# Altium project LVDS_Board.PrjPcb
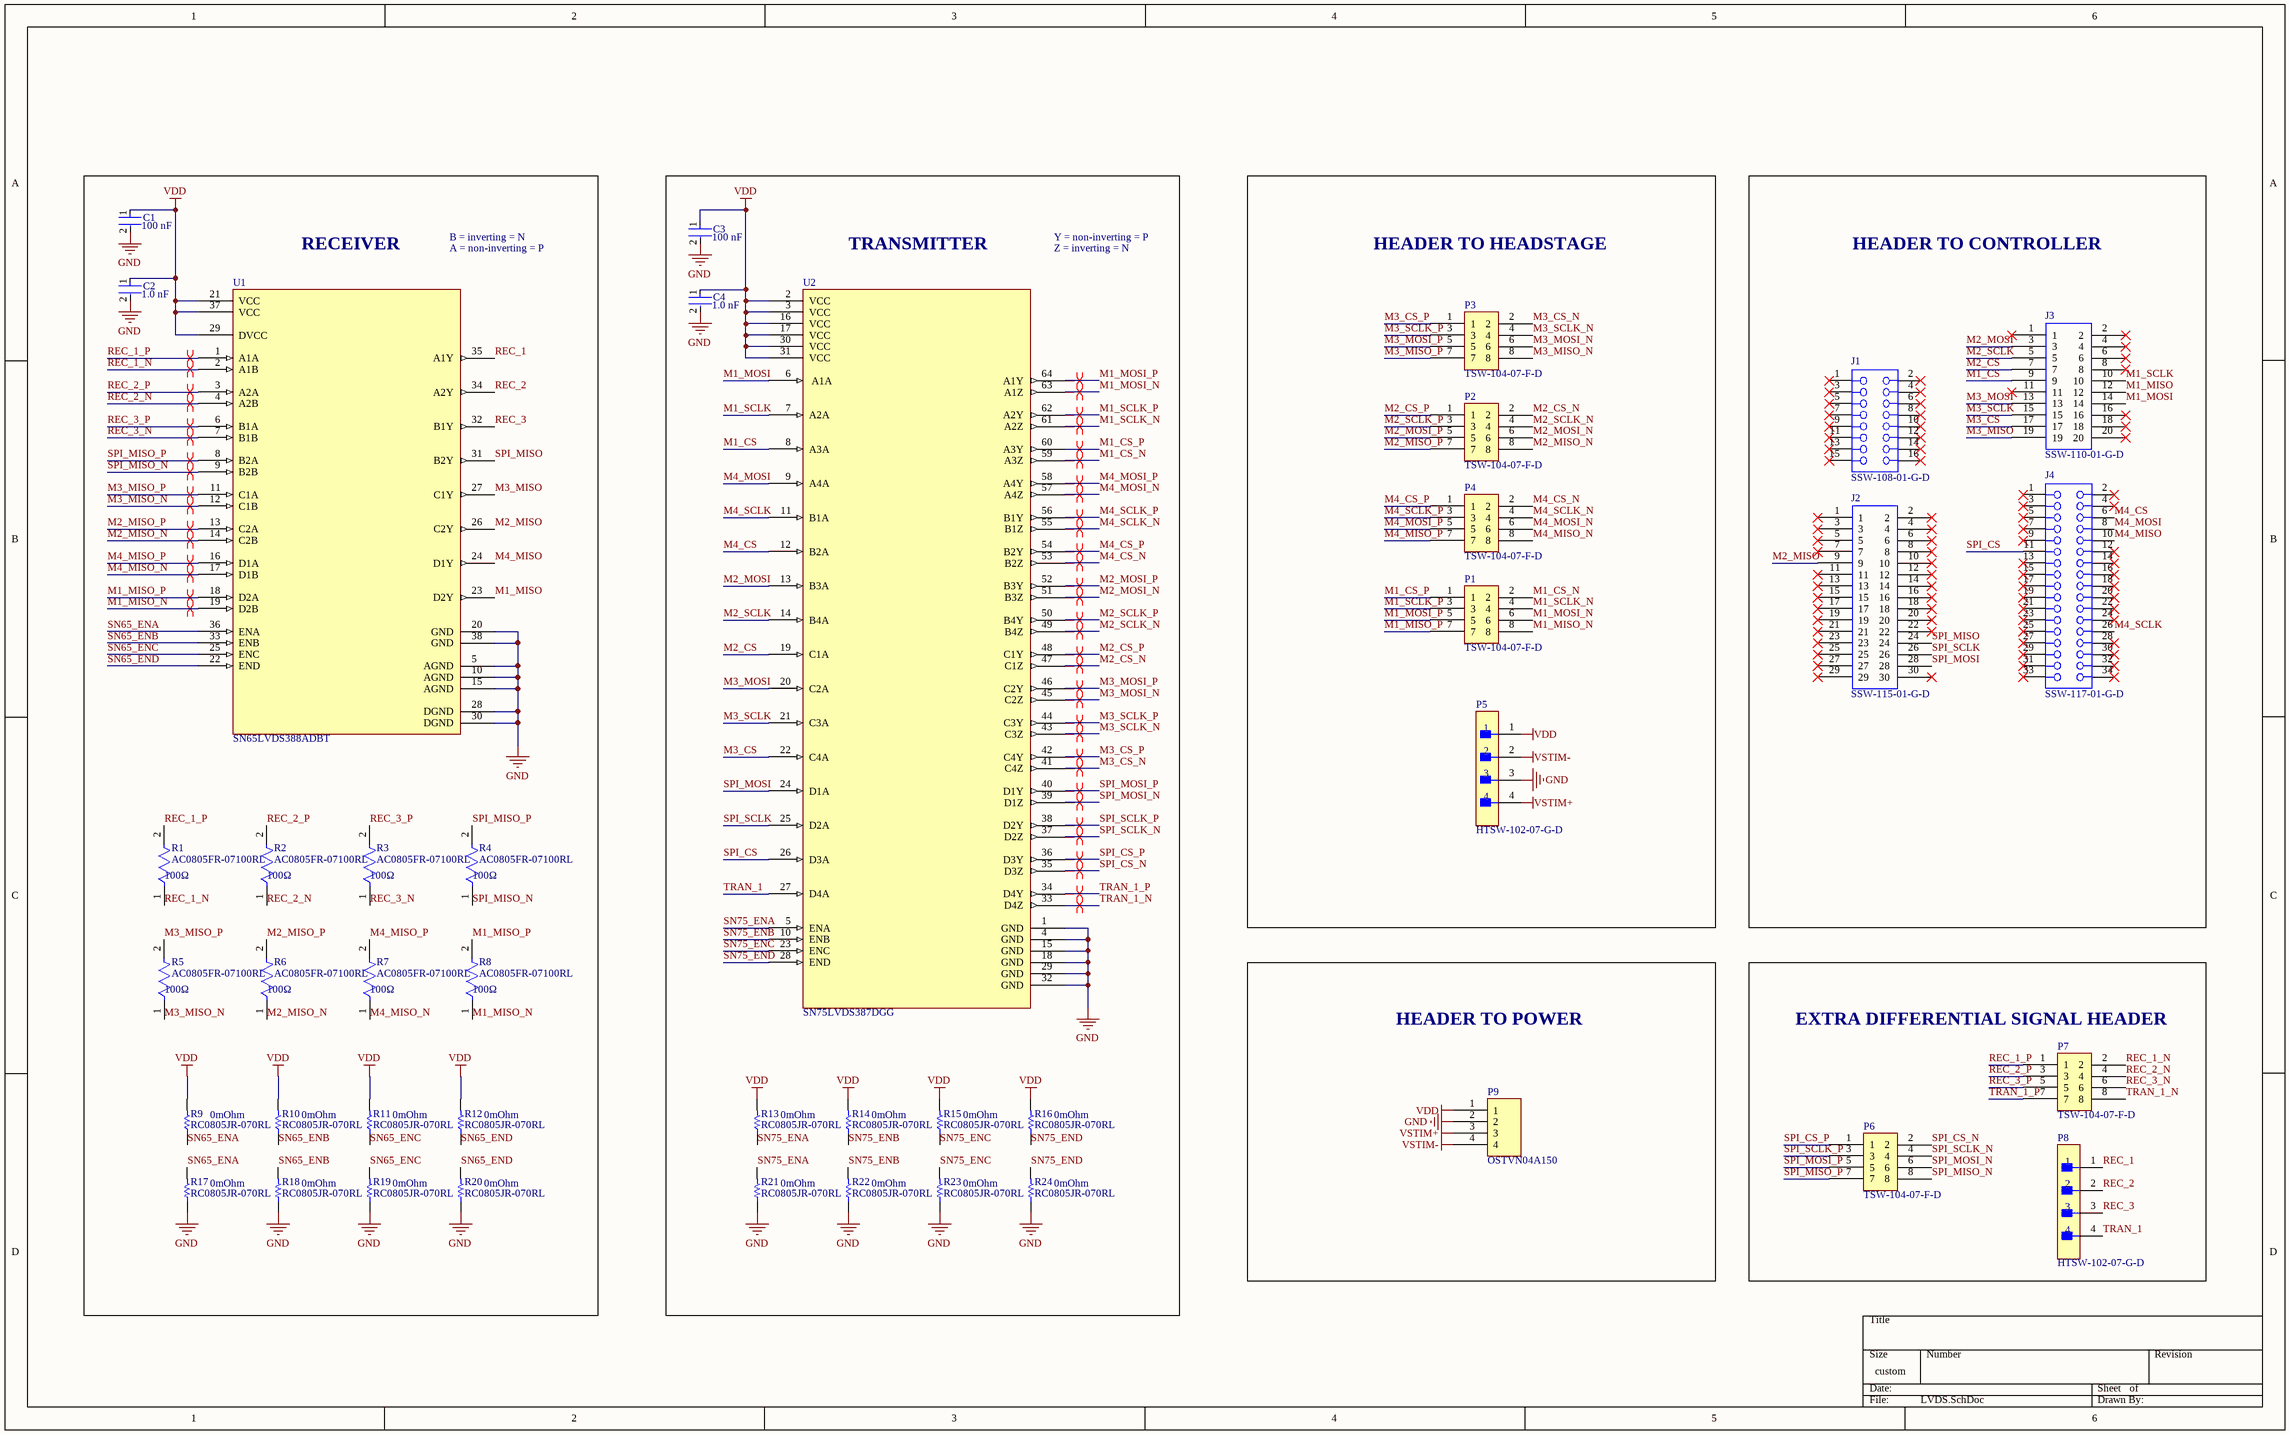
[diagram p0: LVDS.SchDoc]
1 sheet, 43 parts. Net scope: global (net labels, ports and power ports of the same name join across sheets).
Board file: LVDS.PcbDoc

## Sheet LVDS.SchDoc
size 508 x 317 mm; SheetNumber: 1; SheetTotal: 1

### Parts
C1  Capacitance: 100 nF  [FP-CC0805-0_85-MFG]  (hidden comment: CC0805MRX7R9BB104)
C2  Capacitance: 1.0 nF  [FP-CC0805-0_85-MFG]  (hidden comment: CC0805KRX7R9BB102)
C3  Capacitance: 100 nF  [FP-CC0805-0_85-MFG]  (hidden comment: CC0805MRX7R9BB104)
C4  Capacitance: 1.0 nF  [FP-CC0805-0_85-MFG]  (hidden comment: CC0805KRX7R9BB102)
J1  SSW-108-01-G-D  [SMTC-SSW-108-01-X-D]
J2  SSW-115-01-G-D  [SAMTEC_SSW-115-01-G-D]
J3  SSW-110-01-G-D  [SAMTEC_SSW-110-01-G-D]
J4  SSW-117-01-G-D  [SMTC-SSW-117-01-X-D]
P1  TSW-104-07-F-D  [SAMTEC_TSW-104-07-F-D]
P2  TSW-104-07-F-D  [SAMTEC_TSW-104-07-F-D]
P3  TSW-104-07-F-D  [SAMTEC_TSW-104-07-F-D]
P4  TSW-104-07-F-D  [SAMTEC_TSW-104-07-F-D]
P5  HTSW-102-07-G-D  [FP-HTSW-102-07-G-D-MFG]
P6  TSW-104-07-F-D  [SAMTEC_TSW-104-07-F-D]
P7  TSW-104-07-F-D  [SAMTEC_TSW-104-07-F-D]
P8  HTSW-102-07-G-D  [FP-HTSW-102-07-G-D-MFG]
P9  OSTVN04A150  [OSTVN04A150]
R1  AC0805FR-07100RL  Resistance: 100Ω  [FP-AC0805-MFG]
R2  AC0805FR-07100RL  Resistance: 100Ω  [FP-AC0805-MFG]
R3  AC0805FR-07100RL  Resistance: 100Ω  [FP-AC0805-MFG]
R4  AC0805FR-07100RL  Resistance: 100Ω  [FP-AC0805-MFG]
R5  AC0805FR-07100RL  Resistance: 100Ω  [FP-AC0805-MFG]
R6  AC0805FR-07100RL  Resistance: 100Ω  [FP-AC0805-MFG]
R7  AC0805FR-07100RL  Resistance: 100Ω  [FP-AC0805-MFG]
R8  AC0805FR-07100RL  Resistance: 100Ω  [FP-AC0805-MFG]
R9  RC0805JR-070RL  Resistance: 0mOhm  [RESC2013X60X35ML10T20]
R10  RC0805JR-070RL  Resistance: 0mOhm  [RESC2013X60X35ML10T20]
R11  RC0805JR-070RL  Resistance: 0mOhm  [RESC2013X60X35ML10T20]
R12  RC0805JR-070RL  Resistance: 0mOhm  [RESC2013X60X35ML10T20]
R13  RC0805JR-070RL  Resistance: 0mOhm  [RESC2013X60X35ML10T20]
R14  RC0805JR-070RL  Resistance: 0mOhm  [RESC2013X60X35ML10T20]
R15  RC0805JR-070RL  Resistance: 0mOhm  [RESC2013X60X35ML10T20]
R16  RC0805JR-070RL  Resistance: 0mOhm  [RESC2013X60X35ML10T20]
R17  RC0805JR-070RL  Resistance: 0mOhm  [RESC2013X60X35ML10T20]
R18  RC0805JR-070RL  Resistance: 0mOhm  [RESC2013X60X35ML10T20]
R19  RC0805JR-070RL  Resistance: 0mOhm  [RESC2013X60X35ML10T20]
R20  RC0805JR-070RL  Resistance: 0mOhm  [RESC2013X60X35ML10T20]
R21  RC0805JR-070RL  Resistance: 0mOhm  [RESC2013X60X35ML10T20]
R22  RC0805JR-070RL  Resistance: 0mOhm  [RESC2013X60X35ML10T20]
R23  RC0805JR-070RL  Resistance: 0mOhm  [RESC2013X60X35ML10T20]
R24  RC0805JR-070RL  Resistance: 0mOhm  [RESC2013X60X35ML10T20]
U1  SN65LVDS388ADBT  [DBT0038A_N]
U2  SN75LVDS387DGG  [DGG64]

### Blocks framed on the sheet
RECEIVER: C1 C2 R1-R12 R17-R20 U1
TRANSMITTER: C3 C4 R13-R16 R21-R24 U2
HEADER TO HEADSTAGE: P1-P5
HEADER TO CONTROLLER: J1-J4
HEADER TO POWER: P9
EXTRA DIFFERENTIAL SIGNAL HEADER: P6-P8

### Nets
GND: C1.2 C2.2 C3.2 C4.2 P5.3 P9.2 R17.1 R18.1 R19.1 R20.1 R21.1 R22.1 R23.1 R24.1 U1.5(AGND) U1.10(AGND) U1.15(AGND) U1.20(GND) U1.28(DGND) U1.30(DGND) U1.38(GND) U2.1(GND) U2.4(GND) U2.15(GND) U2.18(GND) U2.29(GND) U2.32(GND)
VDD: C1.1 C2.1 C3.1 C4.1 P5.1 P9.1 R9.2 R10.2 R11.2 R12.2 R13.2 R14.2 R15.2 R16.2 U1.21(VCC) U1.29(DVCC) U1.37(VCC) U2.2(VCC) U2.3(VCC) U2.16(VCC) U2.17(VCC) U2.30(VCC) U2.31(VCC)
VSTIM+: P5.4 P9.3
VSTIM-: P5.2 P9.4
M1_CS: J3.9 U2.8(A3A)
M1_CS_N: P1.2 U2.59(A3Z)
M1_CS_P: P1.1 U2.60(A3Y)
M1_MISO: J3.12 U1.23(D2Y)
M1_MISO_N: P1.8 R8.1 U1.19(D2B)
M1_MISO_P: P1.7 R8.2 U1.18(D2A)
M1_MOSI: J3.14 U2.6(A1A)
M1_MOSI_N: P1.6 U2.63(A1Z)
M1_MOSI_P: P1.5 U2.64(A1Y)
M1_SCLK: J3.10 U2.7(A2A)
M1_SCLK_N: P1.4 U2.61(A2Z)
M1_SCLK_P: P1.3 U2.62(A2Y)
M2_CS: J3.7 U2.19(C1A)
M2_CS_N: P2.2 U2.47(C1Z)
M2_CS_P: P2.1 U2.48(C1Y)
M2_MISO: J2.9 U1.26(C2Y)
M2_MISO_N: P2.8 R6.1 U1.14(C2B)
M2_MISO_P: P2.7 R6.2 U1.13(C2A)
M2_MOSI: J3.3 U2.13(B3A)
M2_MOSI_N: P2.6 U2.51(B3Z)
M2_MOSI_P: P2.5 U2.52(B3Y)
M2_SCLK: J3.5 U2.14(B4A)
M2_SCLK_N: P2.4 U2.49(B4Z)
M2_SCLK_P: P2.3 U2.50(B4Y)
M3_CS: J3.17 U2.22(C4A)
M3_CS_N: P3.2 U2.41(C4Z)
M3_CS_P: P3.1 U2.42(C4Y)
M3_MISO: J3.19 U1.27(C1Y)
M3_MISO_N: P3.8 R5.1 U1.12(C1B)
M3_MISO_P: P3.7 R5.2 U1.11(C1A)
M3_MOSI: J3.13 U2.20(C2A)
M3_MOSI_N: P3.6 U2.45(C2Z)
M3_MOSI_P: P3.5 U2.46(C2Y)
M3_SCLK: J3.15 U2.21(C3A)
M3_SCLK_N: P3.4 U2.43(C3Z)
M3_SCLK_P: P3.3 U2.44(C3Y)
M4_CS: J4.6 U2.12(B2A)
M4_CS_N: P4.2 U2.53(B2Z)
M4_CS_P: P4.1 U2.54(B2Y)
M4_MISO: J4.10 U1.24(D1Y)
M4_MISO_N: P4.8 R7.1 U1.17(D1B)
M4_MISO_P: P4.7 R7.2 U1.16(D1A)
M4_MOSI: J4.8 U2.9(A4A)
M4_MOSI_N: P4.6 U2.57(A4Z)
M4_MOSI_P: P4.5 U2.58(A4Y)
M4_SCLK: J4.26 U2.11(B1A)
M4_SCLK_N: P4.4 U2.55(B1Z)
M4_SCLK_P: P4.3 U2.56(B1Y)
REC_1: P8.1 U1.35(A1Y)
REC_1_N: P7.2 R1.1 U1.2(A1B)
REC_1_P: P7.1 R1.2 U1.1(A1A)
REC_2: P8.2 U1.34(A2Y)
REC_2_N: P7.4 R2.1 U1.4(A2B)
REC_2_P: P7.3 R2.2 U1.3(A2A)
REC_3: P8.3 U1.32(B1Y)
REC_3_N: P7.6 R3.1 U1.7(B1B)
REC_3_P: P7.5 R3.2 U1.6(B1A)
SN65_ENA: R9.1 R17.2 U1.36(ENA)
SN65_ENB: R10.1 R18.2 U1.33(ENB)
SN65_ENC: R11.1 R19.2 U1.25(ENC)
SN65_END: R12.1 R20.2 U1.22(END)
SN75_ENA: R13.1 R21.2 U2.5(ENA)
SN75_ENB: R14.1 R22.2 U2.10(ENB)
SN75_ENC: R15.1 R23.2 U2.23(ENC)
SN75_END: R16.1 R24.2 U2.28(END)
SPI_CS: J4.11 U2.26(D3A)
SPI_CS_N: P6.2 U2.35(D3Z)
SPI_CS_P: P6.1 U2.36(D3Y)
SPI_MISO: J2.24 U1.31(B2Y)
SPI_MISO_N: P6.8 R4.1 U1.9(B2B)
SPI_MISO_P: P6.7 R4.2 U1.8(B2A)
SPI_MOSI: J2.28 U2.24(D1A)
SPI_MOSI_N: P6.6 U2.39(D1Z)
SPI_MOSI_P: P6.5 U2.40(D1Y)
SPI_SCLK: J2.26 U2.25(D2A)
SPI_SCLK_N: P6.4 U2.37(D2Z)
SPI_SCLK_P: P6.3 U2.38(D2Y)
TRAN_1: P8.4 U2.27(D4A)
TRAN_1_N: P7.8 U2.33(D4Z)
TRAN_1_P: P7.7 U2.34(D4Y)

Not connected (* = marked no-connect by the designer): J1 1* 2* 3* 4* 5* 6* 7* 8* 9* 10* 11* 12* 13* 14* 15* 16*; J2 1* 2* 3* 4* 5* 6* 7* 8* 10* 11* 12* 13* 14* 15* 16* 17* 18* 19* 20* 21* 22* 23* 25* 27* 29* 30*; J3 1* 2* 4* 6* 8* 11* 16* 18* 20*; J4 1* 2* 3* 4* 5* 7* 9* 12* 13* 14* 15* 16* 17* 18* 19* 20* 21* 22* 23* 24* 25* 27* 28* 29* 30* 31* 32* 33* 34*

### Layout directives
differential pair: M1_CS_N, M1_CS_P, M1_MISO_N, M1_MISO_P, M1_MOSI_N, M1_MOSI_P, M1_SCLK_N, M1_SCLK_P, M2_CS_N, M2_CS_P, M2_MISO_N, M2_MISO_P, M2_MOSI_N, M2_MOSI_P, M2_SCLK_N, M2_SCLK_P, M3_CS_N, M3_CS_P, M3_MISO_N, M3_MISO_P, M3_MOSI_N, M3_MOSI_P, M3_SCLK_N, M3_SCLK_P, M4_CS_N, M4_CS_P, M4_MISO_N, M4_MISO_P, M4_MOSI_N, M4_MOSI_P, M4_SCLK_N, M4_SCLK_P, REC_1_N, REC_1_P, REC_2_N, REC_2_P, REC_3_N, REC_3_P, SPI_CS_N, SPI_CS_P, SPI_MISO_N, SPI_MISO_P, SPI_MOSI_N, SPI_MOSI_P, SPI_SCLK_N, SPI_SCLK_P, TRAN_1_N, TRAN_1_P

### Notes on the sheet
- B = inverting = N
- A = non-inverting = P
- Y = non-inverting = P
- Z = inverting = N

### Library data of the parts
C1 C3 = CMP-03422-000633-1: CAP CER 0.1UF 50V X7R 0805; Manufacturer: Yageo; Tolerance: 0.2; Material: Ceramic; Value: 100 nF; Temperature: -30°C to +85°C; Manufacturer Part Number: CC0805MRX7R9BB104; Ipc Land Pattern Name: CAPC200125X85; Voltage Rating: 50 V; Temperature Characteristic: X7R; Lead Free: Yes; Category: Cap; Mouser Description: Multilayer Ceramic Capacitors MLCC - SMD/SMT 100nF 50V X7R 20%; Octopart: https://octopart.com/cc0805mrx7r9bb104-yageo-30261726; Device Class L2: Capacitors; Digikey Description: CAP CER 0.1UF 50V X7R 0805; Temperature Range High: +85°C; Package: CC0805-0.85; Height: 0.95mm; Device Class L3: Ceramic Capacitors; ComponentLink2URL: http://www.yageo.com/documents/recent/UPY-GPHC_Y5V_6.3V-to-50V_8.pdf; ComponentLink2Description: Datasheet; Automotive: No; RoHS: TRUE; Footprint Url: http://www.yageo.com/exep/pages/download/literatures/UPY-C_GEN_24.pdf; Device Class L1: Passive Components; Temperature Range Low: -30°C
C2 C4 = CMP-1036-02978-3: CAP CER 1000PF 50V X7R 0805; Manufacturer: Yageo; Tolerance: 0.1; Material: Ceramic; Value: 1.0 nF; Ipc Land Pattern Name: CAPC200125X85; Device Class L1: Passive Components; Temperature Range Low: -30°C; Category: Cap; ComponentLink2Description: Datasheet; Temperature: -30°C to +85°C; Device Class L2: Capacitors; Package: CC0805-0.85; Mouser Description: Multilayer Ceramic Capacitors MLCC - SMD/SMT 1.0nF 50V X7R 10%; ComponentLink2URL: http://www.yageo.com/documents/recent/UPY-GPHC_Y5V_6.3V-to-50V_8.pdf; Temperature Characteristic: X7R; Manufacturer Part Number: CC0805KRX7R9BB102; Digikey Description: CAP CER 1000PF 50V X7R 0805; Octopart: https://octopart.com/cc0805krx7r9bb102-yageo-39467744; Footprint Url: http://www.yageo.com/exep/pages/download/literatures/UPY-C_GEN_24.pdf; Temperature Range High: +85°C; Automotive: No; Voltage Rating: 50 V; RoHS: TRUE; Height: 0.95mm; Device Class L3: Ceramic Capacitors; Lead Free: Yes
J1 = CMP-1023-00374-1: SQ Post Socket, Through-hole, Vertical, -55 to 125 degC, 2.54mm Pitch, 16-Pin, Female, RoHS; Manufacturer: Samtec; ComponentLink1Description: Manufacturer URL; DatasheetVersion: F-214; RoHS: True; Orientation: Vertical; Temperature Range: -55 to 125 degC; ComponentLink3URL: http://www.samtec.com/documents/webfiles/cpdf/SSW-1XX-XX-XXX-X-XX-XXX-XX-MKT.pdf; PackageReference: SSW-108-01-X-D; Mounting Technology: Through-hole; Pitch: 2.54 mm; ComponentLink1URL: http://www.samtec.com; ComponentLink2Description: Datasheet; PackageVersion: CA, 6/1987; PackageDescription: Assembly, Socket Strip .016 X .031 Tail; ComponentLink3Description: Package Specification; PartNumber: SSW-108-01-G-D; ComponentLink2URL: http://www.samtec.com/documents/webfiles/pdf/SSW_TH.PDF
J2 = SSW-115-01-G-D: Board Connector, 30 Contact(s), 2 Row(s), Female, Straight, 0.1 inch Pitch, Solder Terminal, Locking, Socket; Manufacturer: Samtec; Manufacturer Series: SSW-1; Option: General Purpose; Contact Pattern: RECTANGULAR; Contact Style: SQ PIN-SKT; Filter Feature: No; Number Of Connectors: 1; Number Of PCB Rows: 2; Number of Contacts: 30; Mating Information: MULTIPLE MATING PARTS AVAILABLE; Additional Feature: TIGER BUY CONTACT; Body Length: 1.52inch; PCB Contact Row Spacing: 2.54mm; Body Breadth: 0.195inch; Plating Thickness: 20uin; Reference Standard: UL; Reliability: COMMERCIAL; Supplier: Arrow Electronics; Supplier Part Number: SSW-115-01-G-D; Manufacturer Part Number: SSW-115-01-G-D; RoHS: Yes; Category: Connectors; Stock: 6; Pricing: 1=5.2116, 10=4.447, 25=4.4359, 50=4.4257, 100=4.0379, 250=3.72, 500=3.5932 (USD); Mounting Technology: Board; Contact Finish - Mating: GOLD (20) OVER NICKEL (50); Insulation Material: Polymer; Contact Finish - Termination: Gold (Au) - with Nickel (Ni) barrier; Contact Material: Bronze; Connector Type: BOARD CONNECTOR; Body/Shell Style: SOCKET; Contact Gender: Female; Mixed Contacts: No; Mounting Style: STRAIGHT; Number of Rows Loaded: 2; PCB Contact Pattern: RECTANGULAR; Termination: Solder; JESD-609 Code: e4; Mating Contact Pitch: 0.1inch; Mating Contact Row Spacing: 0.1inch; Terminal Pitch: 2.54mm; Mounting Option 1: LOCKING; Flammability Rating: UL94 V-0; DIN Conformance: No; IEC Conformance: No; MIL Conformance: No; Reach SVHC Compliant: Yes; RoHS Compliant: Yes; ComponentLink1URL: https://datasheet.ciiva.com:443/pdfs/VipMasterIC/IC/SAMI/SAMI-S-A0000099790/SAMI-S-A0001471334-1.pdf?src-supplier=IHS+Markit; ComponentLink1Description: https://datasheet.ciiva.com:443/pdfs/VipMasterIC/IC/SAMI/SAMI-S-A0000099790/SAMI-S-A0001471334-1.pdf?src-supplier=IHS+Markit; ComponentLink2URL: https://datasheet.ciiva.com/25617/0900766b8115c03d-25617554.pdf?src-supplier=Rs; ComponentLink2Description: https://datasheet.ciiva.com/25617/0900766b8115c03d-25617554.pdf?src-supplier=Rs; ComponentLink3URL: https://datasheet.ciiva.com/22677/82032-22677783.pdf?src-supplier=Element14; ComponentLink3Description: https://datasheet.ciiva.com/22677/82032-22677783.pdf?src-supplier=Element14; ComponentLink4URL: https://datasheet.ciiva.com/749/ssw-1xx-xx-xxx-x-xx-xxx-xx-mkt-749816.pdf?src-supplier=Digi-Key; ComponentLink4Description: https://datasheet.ciiva.com/749/ssw-1xx-xx-xxx-x-xx-xxx-xx-mkt-749816.pdf?src-supplier=Digi-Key
J3 = SSW-110-01-G-D: Board Connector, 20 Contact(s), 2 Row(s), Female, Straight, 0.1 inch Pitch, Solder Terminal, Locking, Socket; Manufacturer: Samtec; Option: General Purpose; Filter Feature: No; Number of Rows Loaded: 2; Number of Contacts: 20; Additional Feature: TIGER BUY CONTACT; Contact Pattern: RECTANGULAR; Contact Style: SQ PIN-SKT; Mating Information: MULTIPLE MATING PARTS AVAILABLE; Number Of Connectors: 1; Body Breadth: 0.195inch; Body Length: 1.02inch; PCB Contact Row Spacing: 2.54mm; Plating Thickness: 20uin; Reference Standard: UL; Reliability: COMMERCIAL; Supplier: Arrow Electronics; Supplier Part Number: SSW-110-01-G-D; Manufacturer Part Number: SSW-110-01-G-D; RoHS: Yes; Category: Headers and Wire Housings; Stock: 34851; Pricing: 1=3.512, 50=3.36, 100=2.897, 500=2.758, 1000=2.425, 2000=2.222, 5000=2.0831, 10000=1.8283, 25000=1.7803, 50000=1.7432 (USD); Mounting Technology: Board; Contact Finish - Mating: GOLD (20) OVER NICKEL (50); Contact Finish - Termination: Gold (Au) - with Nickel (Ni) barrier; Insulation Material: Polymer; Contact Material: Bronze; Connector Type: BOARD CONNECTOR; Body/Shell Style: SOCKET; Contact Gender: Female; Mixed Contacts: No; Mounting Style: STRAIGHT; Termination: Solder; JESD-609 Code: e4; Number Of PCB Rows: 2; PCB Contact Pattern: RECTANGULAR; Terminal Pitch: 2.54mm; Mating Contact Pitch: 0.1inch; Mating Contact Row Spacing: 0.1inch; Mounting Option 1: LOCKING; Flammability Rating: UL94 V-0; Reach SVHC Compliant: Yes; RoHS Compliant: Yes; DIN Conformance: No; IEC Conformance: No; MIL Conformance: No; ComponentLink1URL: https://datasheet.ciiva.com:443/pdfs/VipMasterIC/IC/SAMI/SAMI-S-A0003534850/SAMI-S-A0003534850-1.pdf?src-supplier=IHS+Markit; ComponentLink1Description: https://datasheet.ciiva.com:443/pdfs/VipMasterIC/IC/SAMI/SAMI-S-A0003534850/SAMI-S-A0003534850-1.pdf?src-supplier=IHS+Markit; ComponentLink2URL: https://datasheet.ciiva.com/25617/0900766b8115c03d-25617948.pdf?src-supplier=Rs; ComponentLink2Description: https://datasheet.ciiva.com/25617/0900766b8115c03d-25617948.pdf?src-supplier=Rs; ComponentLink3URL: https://datasheet.ciiva.com/22677/82032-22677781.pdf?src-supplier=Element14; ComponentLink3Description: https://datasheet.ciiva.com/22677/82032-22677781.pdf?src-supplier=Element14; ComponentLink4URL: https://datasheet.ciiva.com/749/ssw-1xx-xx-xxx-x-xx-xxx-xx-mkt-749821.pdf?src-supplier=Digi-Key; ComponentLink4Description: https://datasheet.ciiva.com/749/ssw-1xx-xx-xxx-x-xx-xxx-xx-mkt-749821.pdf?src-supplier=Digi-Key
J4 = CMP-1023-00452-1: SQ Post Socket, Through-hole, Vertical, -55 to 125 degC, 2.54 mm Pitch, 34-Pin, Female, RoHS; Manufacturer: Samtec; Pitch: 2.54 mm; ComponentLink3Description: Package Specification; RoHS: True; PartNumber: SSW-117-01-G-D; ComponentLink1URL: http://www.samtec.com; PackageDescription: Assembly, Socket Strip .016 X .031 Tail; ComponentLink1Description: Manufacturer URL; Temperature Range: -55 to 125 degC; PackageReference: SSW-117-01-X-D; DatasheetVersion: F-214; ComponentLink2URL: http://www.samtec.com/documents/webfiles/pdf/SSW_TH.PDF; Mounting Technology: Through-hole; PackageVersion: CA, 6/1987; ComponentLink3URL: http://www.samtec.com/documents/webfiles/cpdf/SSW-1XX-XX-XXX-X-XX-XXX-XX-MKT.pdf; ComponentLink2Description: Datasheet; Orientation: Vertical
P1-P4 P6 P7 = TSW-104-07-F-D: Board Connector, 8 Contact(s), 2 Row(s), Male, Straight, 0.1 inch Pitch, Solder Terminal, Black Insulator; Manufacturer: Samtec; Option: General Purpose; Filter Feature: No; Number of Rows Loaded: 2; Number of Contacts: 8; Additional Feature: E.L.P.; Mating Information: MULTIPLE MATING PARTS AVAILABLE; Body/Shell Style: RECEPTACLE; Contact Pattern: RECTANGULAR; Contact Style: SQ PIN-SKT; Number Of Connectors: 1; PCB Contact Row Spacing: 5.08mm; Reference Standard: UL; Reliability: COMMERCIAL; Supplier: Arrow Electronics; Supplier Part Number: TSW-104-07-F-D; Manufacturer Part Number: TSW-104-07-F-D; RoHS: Yes; Category: Connectors; Stock: 1; Pricing: 1=0.9123, 50=0.706, 100=0.5756 (USD); Mounting Technology: Board; Contact Finish - Termination: Matte Tin (Sn) - with Nickel (Ni) barrier; Contact Material: Bronze; Contact Finish - Mating: GOLD FLASH OVER NICKEL (50); Insulation Color: Black; Insulation Material: Glass; Connector Type: BOARD CONNECTOR; JESD-609 Code: e3; Contact Gender: Male; Mixed Contacts: No; Mounting Style: STRAIGHT; Termination: Solder; Number Of PCB Rows: 2; PCB Contact Pattern: RECTANGULAR; Terminal Pitch: 2.54mm; Body Breadth: 0.1inch; Body Depth: 0.1inch; Mating Contact Pitch: 0.1inch; Mating Contact Row Spacing: 0.1inch; Terminal Length: 0.1inch; Flammability Rating: UL94 V-0; DIN Conformance: No; IEC Conformance: No; MIL Conformance: No; Reach SVHC Compliant: Yes; RoHS Compliant: Yes; ComponentLink1URL: https://datasheet.ciiva.com:443/pdfs/VipMasterIC/IC/SAMI/SAMI-S-A0003531373/SAMI-S-A0003531373-1.pdf?src-supplier=IHS+Markit; ComponentLink1Description: https://datasheet.ciiva.com:443/pdfs/VipMasterIC/IC/SAMI/SAMI-S-A0003531373/SAMI-S-A0003531373-1.pdf?src-supplier=IHS+Markit; ComponentLink2URL: https://datasheet.ciiva.com/739/tsw-xxx-xx-xxx-x-xx-xxx-mkt-739906.pdf?src-supplier=Digi-Key; ComponentLink2Description: https://datasheet.ciiva.com/739/tsw-xxx-xx-xxx-x-xx-xxx-mkt-739906.pdf?src-supplier=Digi-Key
P5 P8 = CMP-02766-000010-1: CONN HEADER VERT 4POS 2.54MM; Manufacturer: Samtec; Voltage Rating: 550V; Conn Orientation: Straight; Number Of Contacts: 4; Conn Gender: Male; Current Rating: 6.3A; Number Of Rows: 2; Category: Conn; Temperature: -55°C to +125°C; Automotive: No; Digikey Description: CONN HEADER VERT 4POS 2.54MM; ComponentLink2URL: http://suddendocs.samtec.com/catalog_english/htsw_th.pdf; Device Class L2: Headers and Wire Housings; Mouser Description: Conn Unshrouded Header HDR 4 POS 2.54mm Solder ST Thru-Hole Bag; Manufacturer Part Number: HTSW-102-07-G-D; Temperature Range High: +125°C; Contact Material: Gold,Nickel; Temperature Range Low: -55°C; ComponentLink2Description: Datasheet; Device Class L1: Connectors; Pitch: 2.54mm; Octopart: https://octopart.com/htsw-102-07-g-d-samtec-10531767; RoHS: TRUE; Package: HTSW-102-07-G-D; Lead Free: Yes; Device Class L3: unset; Height: 8.71mm
P9 = OSTVN04A150: Barrier Strip Terminal Block, 6A, 1 Row(s), 1 Deck(s); Manufacturer: On-Shore Technology; Fastening Method: SCREW; Additional Feature: STANDARD: UL 94V-0, THERMOPLASTIC; Number of Decks: 1; Number of Ways: 4; Voltage Rating: 125V; Wire/Cable Gauge: 20AWG; Safety Approval: UL,CUL; Supplier: Digi-Key; Supplier Part Number: ED10563-ND; Manufacturer Part Number: OSTVN04A150; RoHS: Yes; Category: Terminal Blocks; Stock: 3152; Pricing: 1=1.39, 10=0.979, 25=0.9128, 50=0.8286, 100=0.8249, 250=0.6966, 500=0.65994, 1000=0.58661, 5000=0.47662 (USD); Mounting Technology: Board; Number of Rows: 1; Current Rating: 6A; Terminal and Terminal Block Type: BARRIER STRIP TERMINAL BLOCK; Reach SVHC Compliant: Yes; RoHS Compliant: Yes; ComponentLink1URL: https://datasheet.ciiva.com:443/pdfs/VipMasterIC/IC/ONST/ONSTS00240/ONSTS00114-1.pdf?src-supplier=IHS+Markit; ComponentLink1Description: https://datasheet.ciiva.com:443/pdfs/VipMasterIC/IC/ONST/ONSTS00240/ONSTS00114-1.pdf?src-supplier=IHS+Markit; ComponentLink2URL: https://datasheet.ciiva.com/823/ostvnxxa150-823966.pdf?src-supplier=Digi-Key; ComponentLink2Description: https://datasheet.ciiva.com/823/ostvnxxa150-823966.pdf?src-supplier=Digi-Key
R1-R8 = CMP-03412-037503-1: Res Thick Film 0805 100 Ohm 1% 1/8W ±100ppm/°C Molded SMD Paper T/R; Manufacturer: Yageo; Voltage Rating: 150V; Tolerance: 0.01; Automotive Grade: Grade 0; Value: 100Ω; Package: AC0805; ComponentLink2URL: http://www.yageo.com/documents/recent/PYu-AC_51_RoHS_L_6.pdf; Device Class L2: Resistors; Mouser Description: Thick Film Resistors 1/8W 100ohm 1% AEC-Q200; Footprint Url: http://www.yageo.com/exep/pages/download/literatures/PYu-R_Mount_10.pdf; Temperature Range Low: -55°C; Manufacturer Part Number: AC0805FR-07100RL; Temperature: -55°C to +155°C; ComponentLink2Description: Datasheet; RoHS: TRUE; Category: Res; Ipc Land Pattern Name: RESC200125X50; Temperature Range High: +155°C; Composition: Thick Film; Octopart: https://octopart.com/ac0805fr-07100rl-yageo-24517276; Device Class L3: Chip SMD Resistors; Height: 0.6mm; Automotive: Yes; Digikey Description: Res Thick Film 0805 100 Ohm 1% 1/8W ±100ppm/°C Molded SMD Paper T/R; Series: AC; Lead Free: Yes; Power Rating: 1/8W; Device Class L1: Passive Components
R9-R24 = CMP-2100-03673-1: Chip Resistor, 0 Ohm, Jumper, +/- 5%, 0.125 W, -55 to 155 degC, 0805 (2012 Metric), RoHS, Tape and Reel; Manufacturer: Yageo; Power Rating: 125mW; Voltage Rating (DC): 150V; Temperature Coefficient: 200ppm/degreesC; Height: 0.5mm; Depth: 1.25mm; Case Code (Imperial): 0805; Lead Free: LeadFree; Military Standard: Not; Package Description: 2-Pin Surface Mounted Device, Body 2 x 1.25 mm; Case Code (Metric): 2012; Composition: ThickFilm; Voltage Rating: 150V; Manufacturer URL: http://www.yageo.com/; Packaging: TapeandReel; Package Reference: 0805; REACH SVHC: Unknown; Tolerance: 5%; Case/Package: 0805; Max Operating Temperature: 155degC; Number of Pins: 2; Min Operating Temperature: -55degC; RoHSCompliant: true; Length: 2mm; Datasheet URL: http://www.yageo.com/NewPortal/yageodocoutput?fileName=/pdf/R-Chip/PYu-RC_Group_51_RoHS_L_5.pdf; Termination: SMD/SMT; Radiation Hardening: No; Width: 1.25mm; Contact Plating: Tin; Datasheet Version: Rev. 5, 10/2016
U1 = SN65LVDS388ADBT: Line Receiver, 8 Func, 8 Rcvr, CMOS, PDSO38; Manufacturer: Texas Instruments; Package Body Material: Plastic; Differential Output: No; Input Characteristics: DIFFERENTIAL; Channels: 8; Output Low Current-Max: 8mA; Power Supplies: 3.3V; Receive Delay-Max: 4ns; Max Supply Current: 40mA; Max Supply Voltage: 3.6V; Min Supply Voltage: 3V; Qualification Status: Not Qualified; Supplier: Digi-Key; Supplier Part Number: 296-6926-5-ND; Manufacturer Part Number: SN65LVDS388ADBT; RoHS: Yes; Category: Interface ICs; Stock: 22; Pricing: 1=6, 10=5.393, 25=5.0984, 100=4.4187, 250=4.19208, 500=3.76156, 1000=3.1724, 2500=3.01378 (USD); Case/Package: TSSOP; Pins: 38; Package Shape: Rectangular; Terminal Finish: Nickel; Min Operating Temperature: -40°C; Max Operating Temperature: 85°C; JESD-609 Code: e4; Interface IC Type: LINE RECEIVER; Moisture Sensitivity Level: 2; Package Style: SMALL OUTLINE, THIN PROFILE, SHRINK PITCHMeter; Peak Reflow Temperature (Cel): 260°C; Receiver Number of Bits: 8; Nominal Supply Voltage: 3.3V; Surface Mount: Yes; Technology: CMOS; Terminal Form: Gull Wing; Terminal Position: DUAL; Length: 9.7mm; Width: 4.4mm; Height - Seated (Max): 1.2mm; Terminal Pitch: 0.5mm; Temperature Grade: INDUSTRIAL; Reach SVHC Compliant: Yes; RoHS Compliant: Yes; ComponentLink1URL: https://www.ti.com:443/lit/ds/symlink/sn65lvds386.pdf?src-supplier=IHS+Markit; ComponentLink1Description: https://www.ti.com:443/lit/ds/symlink/sn65lvds386.pdf?src-supplier=IHS+Markit; ComponentLink2URL: https://datasheet.ciiva.com/1708/sn65lvds386-1708540.pdf?src-supplier=Digi-Key; ComponentLink2Description: https://datasheet.ciiva.com/1708/sn65lvds386-1708540.pdf?src-supplier=Digi-Key; ComponentLink3URL: https://datasheet.ciiva.com/3151/sn65lvds390-3151563.pdf?src-supplier=Avnet; ComponentLink3Description: https://datasheet.ciiva.com/3151/sn65lvds390-3151563.pdf?src-supplier=Avnet; ComponentLink4URL: https://datasheet.ciiva.com/15151/getdatasheetpartid-43449-15151030.pdf?src-supplier=Verical; ComponentLink4Description: https://datasheet.ciiva.com/15151/getdatasheetpartid-43449-15151030.pdf?src-supplier=Verical; ComponentLink5URL: https://datasheet.ciiva.com/1498/1831133-1498284.pdf?src-supplier=Element14; ComponentLink5Description: https://datasheet.ciiva.com/1498/1831133-1498284.pdf?src-supplier=Element14
U2 = SN75LVDS387DGG: Line Driver, 16 Func, 16 Driver, CMOS, PDSO64; Manufacturer: Texas Instruments; Package Body Material: Plastic; Differential Output: Yes; Driver Number of Bits: 16; High Level Input Current-Max: 20uA; Input Characteristics: STANDARD; Out Swing-Min: 247mV; Output Characteristics: 3-STATE; Power Supplies: 3.3V; Receive Delay-Max: 0ns; Max Supply Voltage: 3.6V; Min Supply Voltage: 3V; Transmit Delay-Max: 2.9ns; Qualification Status: Not Qualified; Supplier: Digi-Key; Supplier Part Number: 296-2367-5-ND; Manufacturer Part Number: SN75LVDS387DGG; RoHS: Yes; Category: Interface ICs; Stock: 664; Pricing: 1=12.08, 10=10.913, 25=10.4056, 100=9.035, 250=8.62892, 500=7.86756, 1000=6.85238 (USD); Case/Package: TSSOP; Pins: 64; Package Shape: Rectangular; Terminal Finish: Nickel; Min Operating Temperature: 0°C; Max Operating Temperature: 70°C; JESD-609 Code: e4; Interface IC Type: LINE DRIVER; Moisture Sensitivity Level: 2; Channels: 16; Package Style: SMALL OUTLINE, THIN PROFILE, SHRINK PITCHMeter; Peak Reflow Temperature (Cel): 260°C; Nominal Supply Voltage: 3.3V; Surface Mount: Yes; Technology: CMOS; Terminal Form: Gull Wing; Terminal Position: DUAL; Length: 17mm; Width: 6.1mm; Height - Seated (Max): 1.2mm; Terminal Pitch: 0.5mm; Temperature Grade: COMMERCIAL; Reach SVHC Compliant: Yes; RoHS Compliant: Yes; ComponentLink1URL: https://www.ti.com:443/lit/ds/symlink/sn65lvds387.pdf?src-supplier=IHS+Markit; ComponentLink1Description: https://www.ti.com:443/lit/ds/symlink/sn65lvds387.pdf?src-supplier=IHS+Markit; ComponentLink2URL: https://datasheet.ciiva.com/3151/sn75lvds389-3151600.pdf?src-supplier=Avnet; ComponentLink2Description: https://datasheet.ciiva.com/3151/sn75lvds389-3151600.pdf?src-supplier=Avnet; ComponentLink3URL: https://datasheet.ciiva.com/1709/sn65lvds387-1709399.pdf?src-supplier=Digi-Key; ComponentLink3Description: https://datasheet.ciiva.com/1709/sn65lvds387-1709399.pdf?src-supplier=Digi-Key; ComponentLink4URL: https://datasheet.ciiva.com/1498/668195-1498817.pdf?src-supplier=Element14; ComponentLink4Description: https://datasheet.ciiva.com/1498/668195-1498817.pdf?src-supplier=Element14

## Assembly variants
Main Variant: not fitted R17 R18 R19 R20 R21 R22 R23 R24